# Altium schematic sheet core.SchDoc
size A4; SheetNumber: 1; SheetTotal: 1
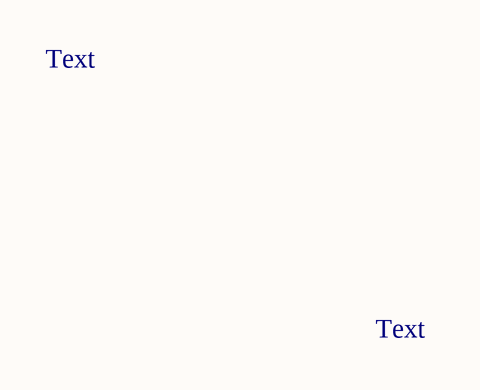
[diagram p0: core.SchDoc]

## Notes on the sheet
- Text